# Altium project ParallelJoysticks.PrjPcb
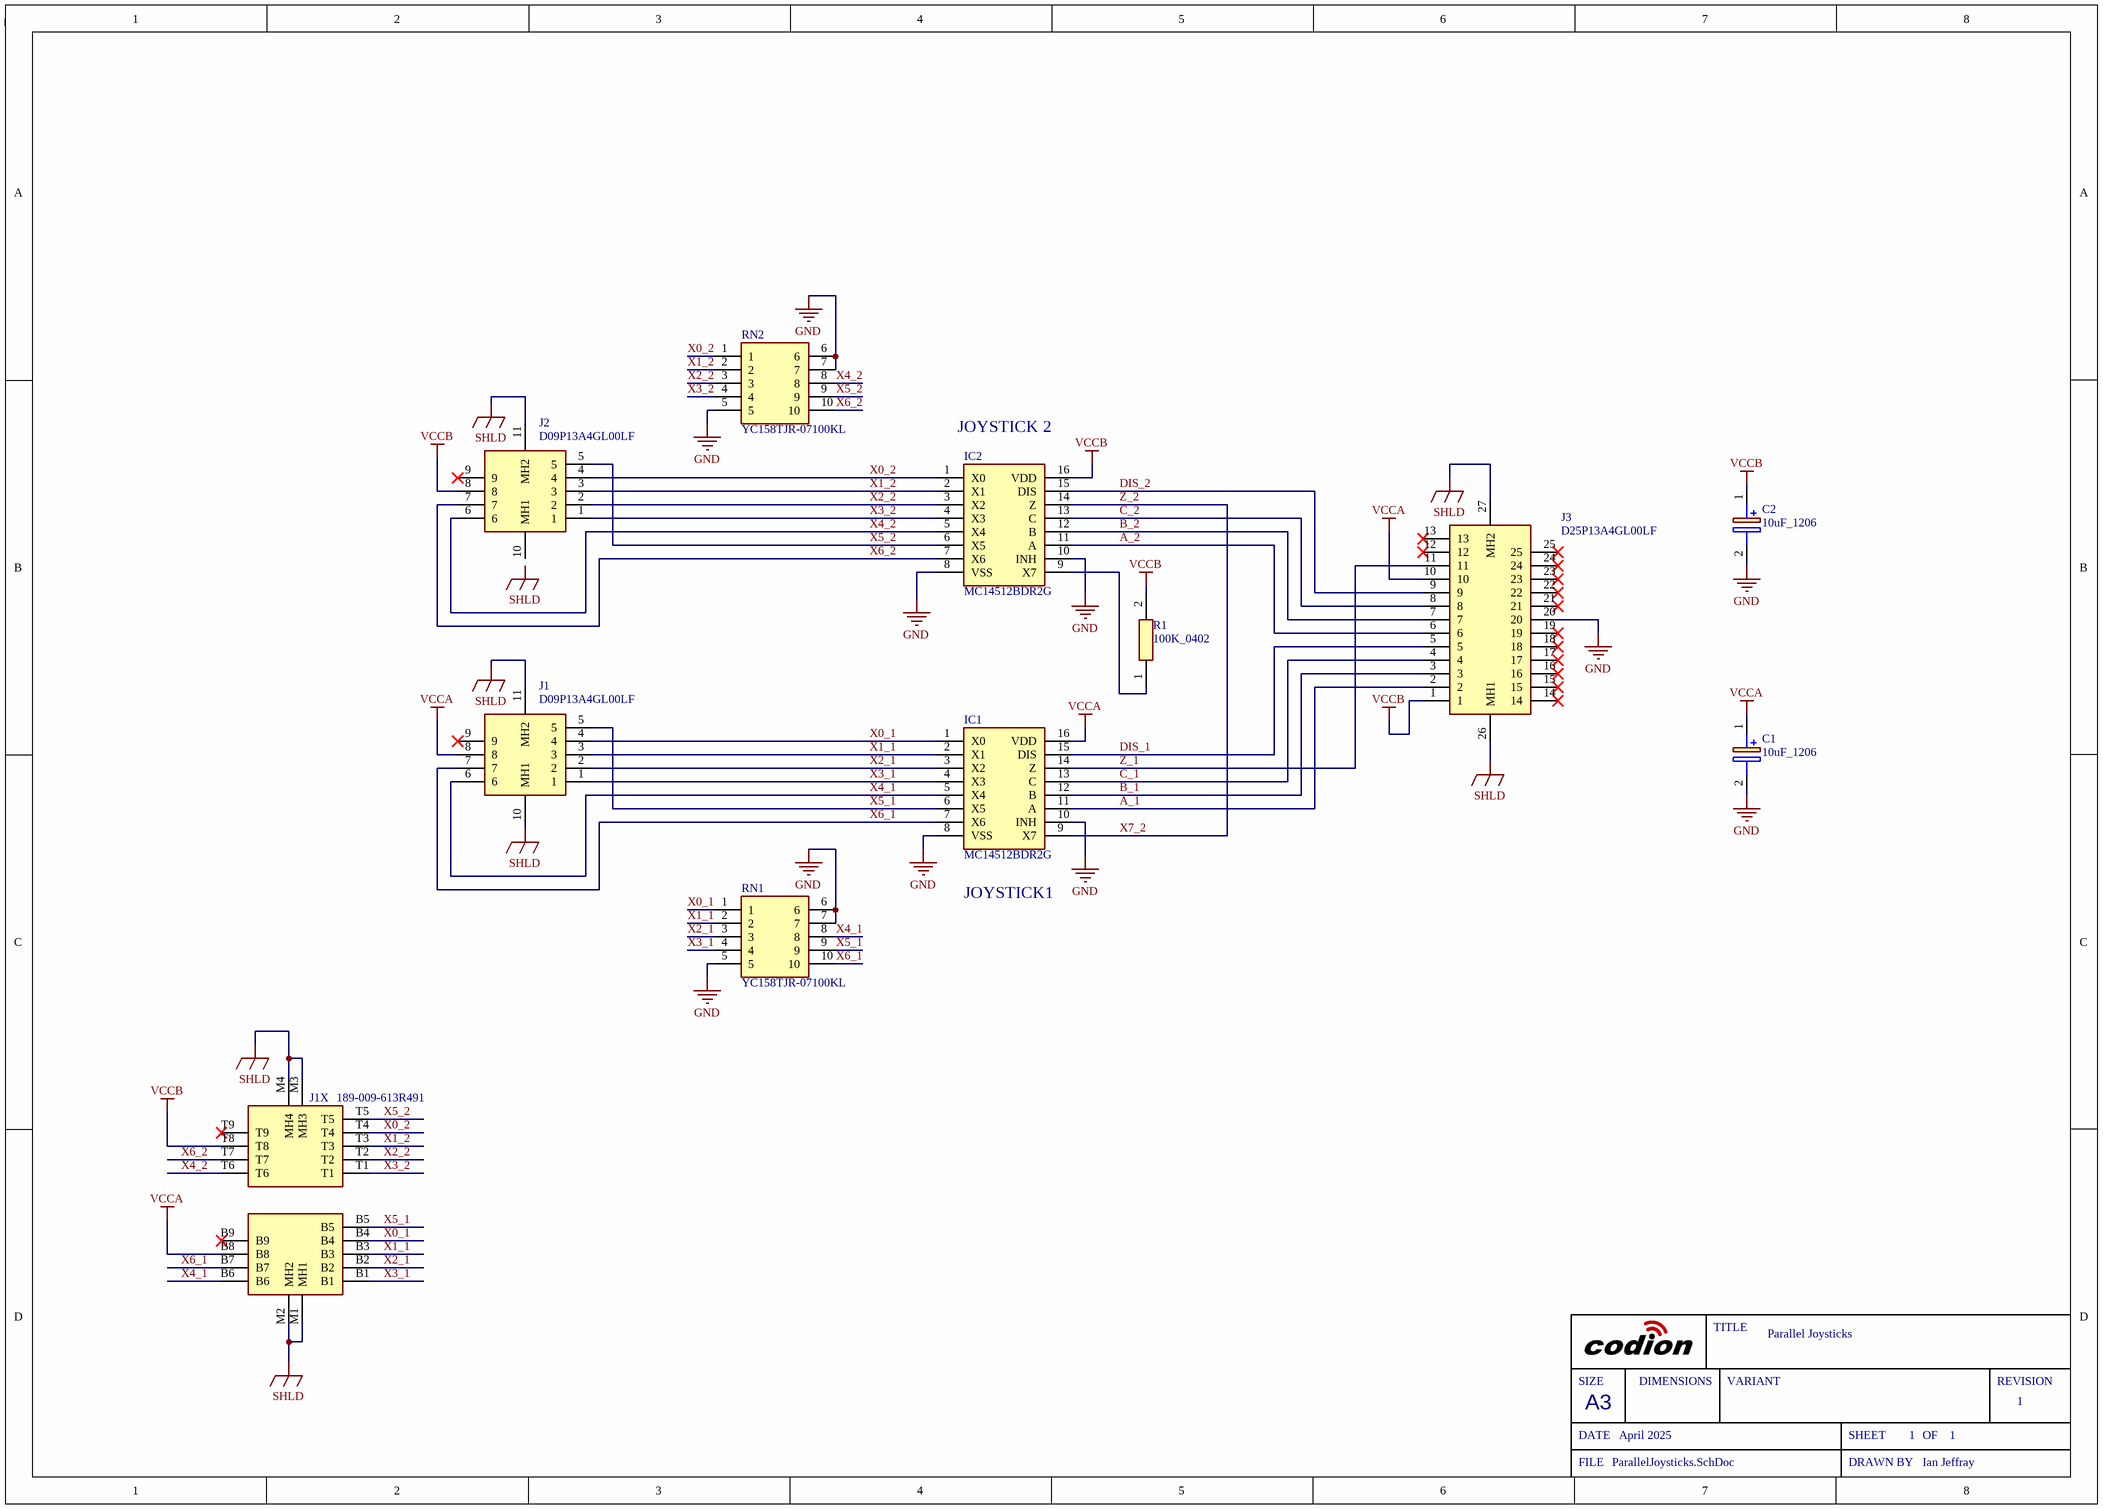
[diagram p0: ParallelJoysticks.SchDoc]
DrawnBy: Ian Jeffray; Project_Title: Parallel Joysticks; Sch_ReleaseDate: April 2025; Sch_RevNo: 1
1 sheet, 11 parts. Net scope: global (net labels, ports and power ports of the same name join across sheets).
Board files: ParallelJoysticks.PcbDoc, ParallelJoysticksVertical.PcbDoc

## Sheet ParallelJoysticks.SchDoc
size A3; SheetNumber: 1; SheetTotal: 1

### Parts
C1  10uF_1206  [CAPPM3216X180N]
C2  10uF_1206  [CAPPM3216X180N]
IC1  MC14512BDR2G  [SOIC127P600X175-16N]
IC2  MC14512BDR2G  [SOIC127P600X175-16N]
J1  D09P13A4GL00LF  [D09P13A4GV00LF]
J1X  189-009-613R491  [189-009-613R491]
J2  D09P13A4GL00LF  [D09P13A4GV00LF]
J3  D25P13A4GL00LF  [D25P13A4GV00LF]
R1  100K_0402  [RESC1005X40N]
RN1  YC158TJR-07100KL  [YC158TJR07100KL]
RN2  YC158TJR-07100KL  [YC158TJR07100KL]

### Nets
GND: C1.2(-) C2.2(-) IC1.8(VSS) IC1.10(INH) IC2.8(VSS) IC2.10(INH) J3.20 RN1.5 RN1.6 RN1.7 RN2.5 RN2.6 RN2.7
SHLD: J1.10(MH1) J1.11(MH2) J1X.M1(MH1) J1X.M2(MH2) J1X.M3(MH3) J1X.M4(MH4) J2.11(MH2) J3.26(MH1) J3.27(MH2)
VCCA: C1.1(+) IC1.16(VDD) J1.8 J1X.B8 J3.10
VCCB: C2.1(+) IC2.16(VDD) J1X.T8 J2.8 J3.1 R1.2
A_1: IC1.11(A) J3.2
A_2: IC2.11(A) J3.6
B_1: IC1.12(B) J3.3
B_2: IC2.12(B) J3.7
C_1: IC1.13(C) J3.4
C_2: IC2.13(C) J3.8
DIS_1: IC1.15(DIS) J3.5
DIS_2: IC2.15(DIS) J3.9
X0_1: IC1.1(X0) J1.4 J1X.B4 RN1.1
X0_2: IC2.1(X0) J1X.T4 J2.4 RN2.1
X1_1: IC1.2(X1) J1.3 J1X.B3 RN1.2
X1_2: IC2.2(X1) J1X.T3 J2.3 RN2.2
X2_1: IC1.3(X2) J1.2 J1X.B2 RN1.3
X2_2: IC2.3(X2) J1X.T2 J2.2 RN2.3
X3_1: IC1.4(X3) J1.1 J1X.B1 RN1.4
X3_2: IC2.4(X3) J1X.T1 J2.1 RN2.4
X4_1: IC1.5(X4) J1.6 J1X.B6 RN1.8
X4_2: IC2.5(X4) J1X.T6 J2.6 RN2.8
X5_1: IC1.6(X5) J1.5 J1X.B5 RN1.9
X5_2: IC2.6(X5) J1X.T5 J2.5 RN2.9
X6_1: IC1.7(X6) J1.7 J1X.B7 RN1.10
X6_2: IC2.7(X6) J1X.T7 J2.7 RN2.10
X7_2: IC1.9(X7) IC2.14(Z)  [also labelled Z_2]
Z_1: IC1.14(Z) J3.11
NetIC2_9: IC2.9(X7) R1.1

Not connected (* = marked no-connect by the designer): J1 9*; J1X B9* T9*; J2 9* 10(MH1); J3 12* 13* 14* 15* 16* 17* 18* 19* 21* 22* 23* 24* 25*

### Notes on the sheet
- (near IC2) JOYSTICK 2
- (near IC1) JOYSTICK1
- Labels drawn without touching a wire or pin: SHLD
- SIZE
- DIMENSIONS
- TITLE
- VARIANT
- REVISION
- DATE
- A3
- SHEET
- OF
- FILE
- DRAWN BY

### Library data of the parts
C1 C2 = TAJA106M010RNJ: Capacitor Polarised; Manufacturer_Name: Kyocera AVX; Datasheet Link: http://www.farnell.com/datasheets/1680476.pdf; Height: 1.8mm; Manufacturer_Part_Number: TAJA106M010RNJ; Mouser Part Number: 581-TAJA106M010R; Mouser Price/Stock: https://www.mouser.co.uk/ProductDetail/KYOCERA-AVX/TAJA106M010RNJ?qs=OVpPYgiJXXXkHCh9%252BEALWw%3D%3D; Arrow Part Number: TAJA106M010RNJ; Arrow Price/Stock: https://www.arrow.com/en/products/taja106m010rnj/avx?utm_currency=USD&region=nac
IC1 IC2 = MC14512BDR2G: Integrated Circuit; Manufacturer_Name: onsemi; Datasheet Link: https://www.onsemi.com/pub/Collateral/MC14512B-D.PDF; Height: 1.75mm; Manufacturer_Part_Number: MC14512BDR2G; Mouser Part Number: 863-MC14512BDR2G; Mouser Price/Stock: https://www.mouser.co.uk/ProductDetail/onsemi/MC14512BDR2G?qs=g2rIOKKlpoaxQ58M9hSKIg%3D%3D; Arrow Part Number: MC14512BDR2G; Arrow Price/Stock: https://www.arrow.com/en/products/mc14512bdr2g/on-semiconductor
J1 J2 = D09P13A4GV00LF: Connector; Manufacturer_Name: Amphenol Communications Solutions; Datasheet Link: https://cdn.amphenol-cs.com/media/wysiwyg/files/drawing/c01-8646-0742.pdf; Height: 13.86mm; Manufacturer_Part_Number: D09P13A4GL00LF
J1X = 189-009-613R491: Connector
J3 = D25P13A4GV00LF: Connector; Manufacturer_Name: Amphenol Communications Solutions; Datasheet Link: https://cdn.amphenol-cs.com/media/wysiwyg/files/drawing/c01-8646-0742.pdf; Height: 13.86mm; Manufacturer_Part_Number: D25P13A4GL00LF
R1 = CRCW0402100KFKEDHP: Resistor; Manufacturer_Name: Vishay; Datasheet Link: http://www.vishay.com/docs/20035/dcrcwe3.pdf; Height: 0.4mm; Manufacturer_Part_Number: CRCW0402100KFKEDHP; Mouser Part Number: 71-CRCW0402100KFKEDH; Mouser Price/Stock: https://www.mouser.co.uk/ProductDetail/Vishay-Dale/CRCW0402100KFKEDHP?qs=k2%2FDWSARqgGFakjlJe4Ejw%3D%3D; Arrow Part Number: CRCW0402100KFKEDHP; Arrow Price/Stock: https://www.arrow.com/en/products/crcw0402100kfkedhp/vishay?utm_currency=USD&region=nac
RN1 RN2 = YC158TJR-07100KL: Resistor Network; Manufacturer_Name: KEMET; Datasheet Link: https://media.digikey.com/pdf/Data%20Sheets/Yageo%20PDFs/YC102-358,TC122-164_Series_DS.pdf; Height: 0.7mm; Manufacturer_Part_Number: YC158TJR-07100KL; Mouser Part Number: 603-YC158TJR-07100KL; Mouser Price/Stock: https://www.mouser.com/Search/Refine.aspx?Keyword=603-YC158TJR-07100KL; Arrow Part Number: YC158TJR-07100KL; Arrow Price/Stock: https://www.arrow.com/en/products/yc158tjr-07100kl/yageo?region=nac